# EasyEDA schematic SCH_ESPHome-Aldes-T.One-Basic-v1.0_2024-12-31.json
TITLE: ESPHome Aldes T.One - Base V1; REV: 1.0; Date: 2024-12-12; Sheet: 1/1; Drawn By: hugz; Company: Your Company
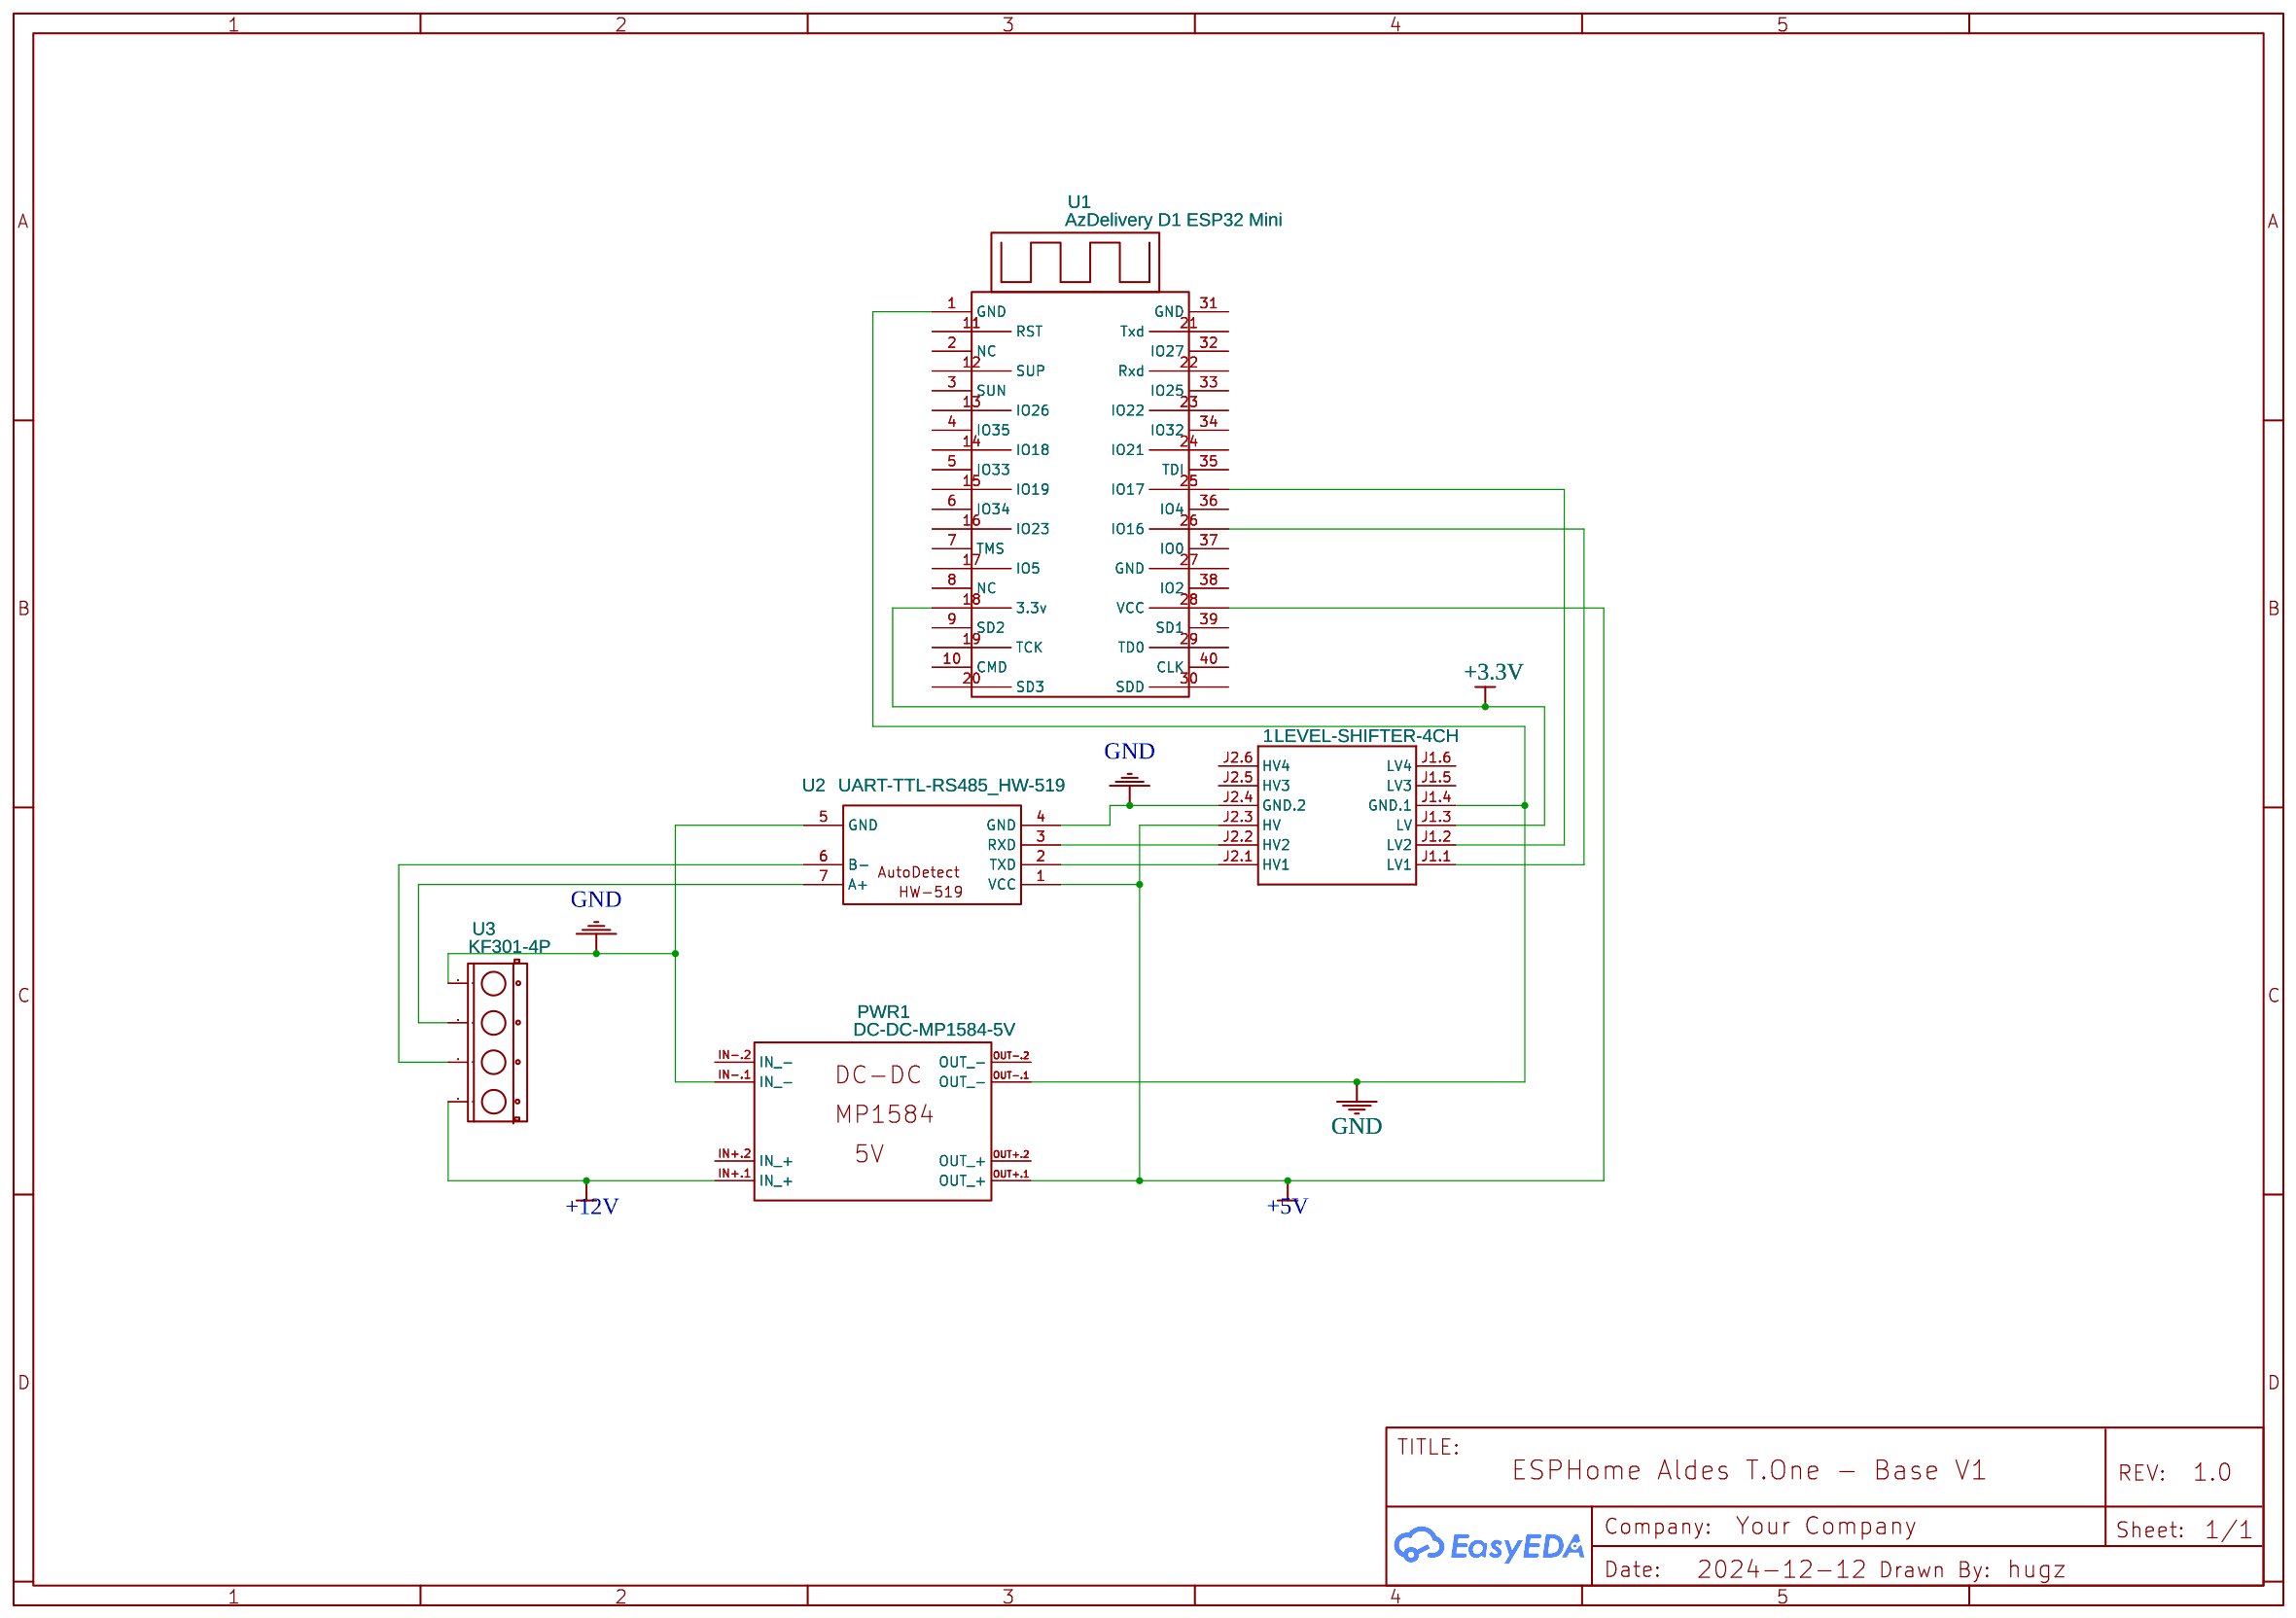
[diagram p0: schematic sheet]

## Parts
1  LEVEL-SHIFTER-4CH  [LEVEL-SHIFTER-4CH]
PWR1  DC-DC-MP1584-5V  [DC-DC-STEP-DOWN-MP1584]
U1  AzDelivery D1 ESP32 Mini  [AZDELIVERYD1 ESP32 MINI]
U2  UART-TTL-RS485_HW-519  [UART-TTL-RS485. V2]
U3  KF301-4P  [KF301-4P]

## Library data of the parts
1 = LEVEL-SHIFTER-4CH: Contributor: Dimitri Chiminello
PWR1 = DC-DC-MP1584-5V: Contributor: karel.slavicek
U1 = AzDelivery D1 ESP32 Mini: Manufacturer: AzDelivery; Manufacturer Part: D1 Mini ESP32; Supplier: AzDelivery; Supplier Part: D1 mini ESP32; link: https://www.az-delivery.de/nl/products/esp32-d1-mini; Contributor: Jelke
U2 = UART-TTL-RS485_HW-519: Contributor: Compesalogger
U3 = KF301-4P: Manufacturer Part: KF301; Contributor: Slape_tex

## Nets
+3.3V: 1.J1.3(LV) U1.18(3.3v)
+5V: 1.J2.3(HV) PWR1.OUT+.1(OUT +) U1.28(VCC) U2.1(VCC)
+12V: PWR1.IN+.1(IN +) U3.4
GND: 1.J1.4(GND.1) 1.J2.4(GND.2) PWR1.IN-.1(IN -) PWR1.OUT-.1(OUT -) U1.1(GND) U2.4(GND) U2.5(GND) U3.1
Net-(1-J1.1): 1.J1.1(LV1) U1.26(IO16)
Net-(1-J1.2): 1.J1.2(LV2) U1.25(IO17)
Net-(1-J2.1): 1.J2.1(HV1) U2.2(TXD)
Net-(1-J2.2): 1.J2.2(HV2) U2.3(RXD)
Net-(U2-6): U2.6(B-) U3.3
Net-(U2-7): U2.7(A+) U3.2

Not connected (* = marked no-connect by the designer): 1 J1.5(LV3) J1.6(LV4) J2.5(HV3) J2.6(HV4); PWR1 IN+.2(IN +) IN-.2(IN -) OUT+.2(OUT +) OUT-.2(OUT -); U1 2(NC) 3(SUN) 4(IO35) 5(IO33) 6(IO34) 7(TMS) 8(NC) 9(SD2) 10(CMD) 11(RST) 12(SUP) 13(IO26) 14(IO18) 15(IO19) 16(IO23) 17(IO5) 19(TCK) 20(SD3) 21(Txd) 22(Rxd) 23(IO22) 24(IO21) 27(GND) 29(TD0) 30(SDD) 31(GND) 32(IO27) 33(IO25) 34(IO32) 35(TDI) 36(IO4) 37(IO0) 38(IO2) 39(SD1) 40(CLK)
